# EAGLE design M640X (EAGLE 6.6.0)
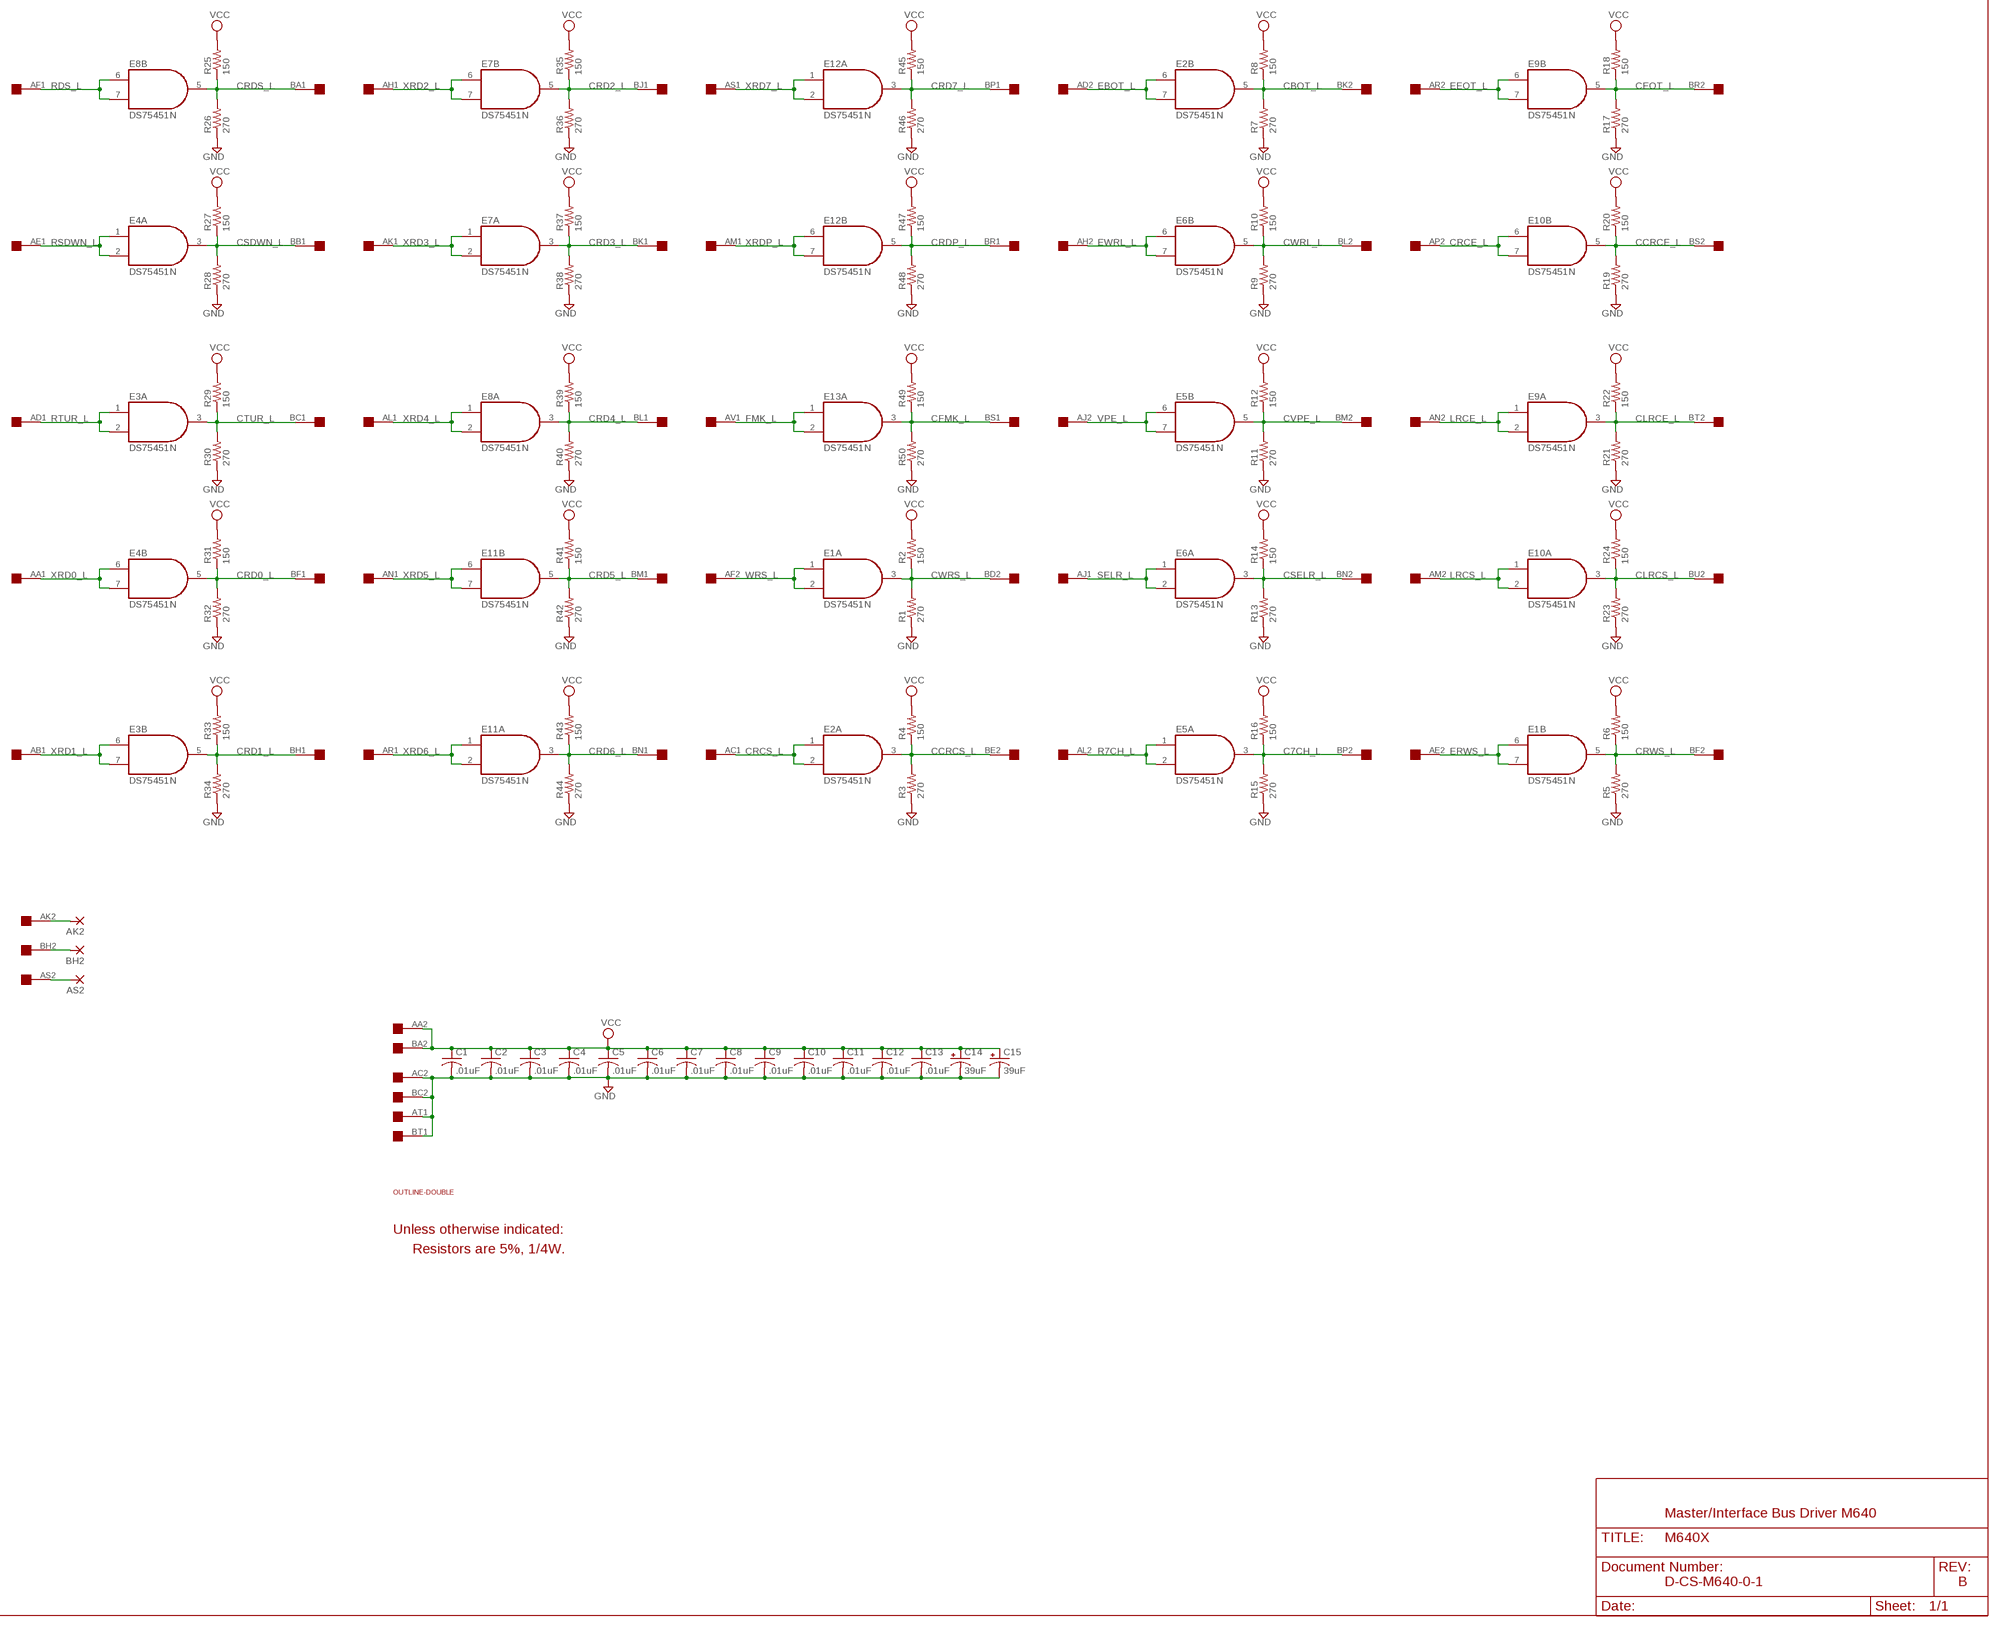
[diagram p0: schematic, sheet 1]

## Parts
AK2  1,6/0,8  [1,6/0,8]
AS2  1,6/0,8  [1,6/0,8]
BH2  1,6/0,8  [1,6/0,8]
C1  .01uF  C-US050-025X075  [C050-025X075]
C2  .01uF  C-US050-025X075  [C050-025X075]
C3  .01uF  C-US050-025X075  [C050-025X075]
C4  .01uF  C-US050-025X075  [C050-025X075]
C5  .01uF  C-US050-025X075  [C050-025X075]
C6  .01uF  C-US050-025X075  [C050-025X075]
C7  .01uF  C-US050-025X075  [C050-025X075]
C8  .01uF  C-US050-025X075  [C050-025X075]
C9  .01uF  C-US050-025X075  [C050-025X075]
C10  .01uF  C-US050-025X075  [C050-025X075]
C11  .01uF  C-US050-025X075  [C050-025X075]
C12  .01uF  C-US050-025X075  [C050-025X075]
C13  .01uF  C-US050-025X075  [C050-025X075]
C14  39uF  CPOL-USE20-8AXIAL  [E12-8]
C15  39uF  CPOL-USE20-8AXIAL  [E12-8]
E1  DS75451N  [DIL08]
E2  DS75451N  [DIL08]
E3  DS75451N  [DIL08]
E4  DS75451N  [DIL08]
E5  DS75451N  [DIL08]
E6  DS75451N  [DIL08]
E7  DS75451N  [DIL08]
E8  DS75451N  [DIL08]
E9  DS75451N  [DIL08]
E10  DS75451N  [DIL08]
E11  DS75451N  [DIL08]
E12  DS75451N  [DIL08]
E13  DS75451N  [DIL08]
R1  270  R-US_0207/10  [0207/10]
R2  150  R-US_0207/10  [0207/10]
R3  270  R-US_0207/10  [0207/10]
R4  150  R-US_0207/10  [0207/10]
R5  270  R-US_0207/10  [0207/10]
R6  150  R-US_0207/10  [0207/10]
R7  270  R-US_0207/10  [0207/10]
R8  150  R-US_0207/10  [0207/10]
R9  270  R-US_0207/10  [0207/10]
R10  150  R-US_0207/10  [0207/10]
R11  270  R-US_0207/10  [0207/10]
R12  150  R-US_0207/10  [0207/10]
R13  270  R-US_0207/10  [0207/10]
R14  150  R-US_0207/10  [0207/10]
R15  270  R-US_0207/10  [0207/10]
R16  150  R-US_0207/10  [0207/10]
R17  270  R-US_0207/10  [0207/10]
R18  150  R-US_0207/10  [0207/10]
R19  270  R-US_0207/10  [0207/10]
R20  150  R-US_0207/10  [0207/10]
R21  270  R-US_0207/10  [0207/10]
R22  150  R-US_0207/10  [0207/10]
R23  270  R-US_0207/10  [0207/10]
R24  150  R-US_0207/10  [0207/10]
R25  150  R-US_0207/10  [0207/10]
R26  270  R-US_0207/10  [0207/10]
R27  150  R-US_0207/10  [0207/10]
R28  270  R-US_0207/10  [0207/10]
R29  150  R-US_0207/10  [0207/10]
R30  270  R-US_0207/10  [0207/10]
R31  150  R-US_0207/10  [0207/10]
R32  270  R-US_0207/10  [0207/10]
R33  150  R-US_0207/10  [0207/10]
R34  270  R-US_0207/10  [0207/10]
R35  150  R-US_0207/10  [0207/10]
R36  270  R-US_0207/10  [0207/10]
R37  150  R-US_0207/10  [0207/10]
R38  270  R-US_0207/10  [0207/10]
R39  150  R-US_0207/10  [0207/10]
R40  270  R-US_0207/10  [0207/10]
R41  150  R-US_0207/10  [0207/10]
R42  270  R-US_0207/10  [0207/10]
R43  150  R-US_0207/10  [0207/10]
R44  270  R-US_0207/10  [0207/10]
R45  150  R-US_0207/10  [0207/10]
R46  270  R-US_0207/10  [0207/10]
R47  150  R-US_0207/10  [0207/10]
R48  270  R-US_0207/10  [0207/10]
R49  150  R-US_0207/10  [0207/10]
R50  270  R-US_0207/10  [0207/10]
U$1  DOUBLE  [EDGE-CON4]
U$2  OUTLINE-DOUBLE  [DOUBLE]

## Nets
C7CH_L: E5.3(A:O) R15.2 R16.1 U$1.BP2
CBOT_L: E2.5(B:O) R7.2 R8.1 U$1.BK2
CCRCE_L: E10.5(B:O) R19.2 R20.1 U$1.BS2
CCRCS_L: E2.3(A:O) R3.2 R4.1 U$1.BE2
CEOT_L: E9.5(B:O) R17.2 R18.1 U$1.BR2
CFMK_L: E13.3(A:O) R49.1 R50.2 U$1.BS1
CLRCE_L: E9.3(A:O) R21.2 R22.1 U$1.BT2
CLRCS_L: E10.3(A:O) R23.2 R24.1 U$1.BU2
CRCE_L: E10.6(B:I0) E10.7(B:I1) U$1.AP2
CRCS_L: E2.1(A:I0) E2.2(A:I1) U$1.AC1
CRD0_L: E4.5(B:O) R31.1 R32.2 U$1.BF1
CRD1_L: E3.5(B:O) R33.1 R34.2 U$1.BH1
CRD2_L: E7.5(B:O) R35.1 R36.2 U$1.BJ1
CRD3_L: E7.3(A:O) R37.1 R38.2 U$1.BK1
CRD4_L: E8.3(A:O) R39.1 R40.2 U$1.BL1
CRD5_L: E11.5(B:O) R41.1 R42.2 U$1.BM1
CRD6_L: E11.3(A:O) R43.1 R44.2 U$1.BN1
CRD7_L: E12.3(A:O) R45.1 R46.2 U$1.BP1
CRDP_L: E12.5(B:O) R47.1 R48.2 U$1.BR1
CRDS_L: E8.5(B:O) R25.1 R26.2 U$1.BA1
CRWS_L: E1.5(B:O) R5.2 R6.1 U$1.BF2
CSDWN_L: E4.3(A:O) R27.1 R28.2 U$1.BB1
CSELR_L: E6.3(A:O) R13.2 R14.1 U$1.BN2
CTUR_L: E3.3(A:O) R29.1 R30.2 U$1.BC1
CVPE_L: E5.5(B:O) R11.2 R12.1 U$1.BM2
CWRL_L: E6.5(B:O) R9.2 R10.1 U$1.BL2
CWRS_L: E1.3(A:O) R1.2 R2.1 U$1.BD2
EBOT_L: E2.6(B:I0) E2.7(B:I1) U$1.AD2
EEOT_L: E9.6(B:I0) E9.7(B:I1) U$1.AR2
ERWS_L: E1.6(B:I0) E1.7(B:I1) U$1.AE2
EWRL_L: E6.6(B:I0) E6.7(B:I1) U$1.AH2
FMK_L: E13.1(A:I0) E13.2(A:I1) U$1.AV1
GND [Supply]: C1.2 C2.2 C3.2 C4.2 C5.2 C6.2 C7.2 C8.2 C9.2 C10.2 C11.2 C12.2 C13.2 C14.- C15.- R1.1 R3.1 R5.1 R7.1 R9.1 R11.1 R13.1 R15.1 R17.1 R19.1 R21.1 R23.1 R26.1 R28.1 R30.1 R32.1 R34.1 R36.1 R38.1 R40.1 R42.1 R44.1 R46.1 R48.1 R50.1 U$1.AC2 U$1.AT1 U$1.BC2 U$1.BT1
LRCE_L: E9.1(A:I0) E9.2(A:I1) U$1.AN2
LRCS_L: E10.1(A:I0) E10.2(A:I1) U$1.AM2
N$1: AK2.1(P) U$1.AK2
N$2: BH2.1(P) U$1.BH2
N$3: AS2.1(P) U$1.AS2
R7CH_L: E5.1(A:I0) E5.2(A:I1) U$1.AL2
RDS_L: E8.6(B:I0) E8.7(B:I1) U$1.AF1
RSDWN_L: E4.1(A:I0) E4.2(A:I1) U$1.AE1
RTUR_L: E3.1(A:I0) E3.2(A:I1) U$1.AD1
SELR_L: E6.1(A:I0) E6.2(A:I1) U$1.AJ1
VCC [Supply]: C1.1 C2.1 C3.1 C4.1 C5.1 C6.1 C7.1 C8.1 C9.1 C10.1 C11.1 C12.1 C13.1 C14.+ C15.+ R2.2 R4.2 R6.2 R8.2 R10.2 R12.2 R14.2 R16.2 R18.2 R20.2 R22.2 R24.2 R25.2 R27.2 R29.2 R31.2 R33.2 R35.2 R37.2 R39.2 R41.2 R43.2 R45.2 R47.2 R49.2 U$1.AA2 U$1.BA2
VPE_L: E5.6(B:I0) E5.7(B:I1) U$1.AJ2
WRS_L: E1.1(A:I0) E1.2(A:I1) U$1.AF2
XRD0_L: E4.6(B:I0) E4.7(B:I1) U$1.AA1
XRD1_L: E3.6(B:I0) E3.7(B:I1) U$1.AB1
XRD2_L: E7.6(B:I0) E7.7(B:I1) U$1.AH1
XRD3_L: E7.1(A:I0) E7.2(A:I1) U$1.AK1
XRD4_L: E8.1(A:I0) E8.2(A:I1) U$1.AL1
XRD5_L: E11.6(B:I0) E11.7(B:I1) U$1.AN1
XRD6_L: E11.1(A:I0) E11.2(A:I1) U$1.AR1
XRD7_L: E12.1(A:I0) E12.2(A:I1) U$1.AS1
XRDP_L: E12.6(B:I0) E12.7(B:I1) U$1.AM1
Unconnected: E13.5(B:O) E13.6(B:I0) E13.7(B:I1) U$1.AB2 U$1.AP1 U$1.AT2 U$1.AU1 U$1.AU2 U$1.AV2 U$1.BB2 U$1.BD1 U$1.BE1 U$1.BJ2 U$1.BU1 U$1.BV1 U$1.BV2

## Notes on the sheet
- Unless otherwise indicated:
- Resistors are 5%, 1/4W.
- Master/Interface Bus Driver M640
- D-CS-M640-0-1 | B

## Power pins joined to a net without a drawn wire
GND: E1.4(PWR:GND) E2.4(PWR:GND) E3.4(PWR:GND) E4.4(PWR:GND) E5.4(PWR:GND) E6.4(PWR:GND) E7.4(PWR:GND) E8.4(PWR:GND) E9.4(PWR:GND) E10.4(PWR:GND) E11.4(PWR:GND) E12.4(PWR:GND) E13.4(PWR:GND)
VCC: E1.8(PWR:VCC) E2.8(PWR:VCC) E3.8(PWR:VCC) E4.8(PWR:VCC) E5.8(PWR:VCC) E6.8(PWR:VCC) E7.8(PWR:VCC) E8.8(PWR:VCC) E9.8(PWR:VCC) E10.8(PWR:VCC) E11.8(PWR:VCC) E12.8(PWR:VCC) E13.8(PWR:VCC)

## Library data of the parts
AK2 AS2 BH2 = wirepad:1,6/0,8: THROUGH-HOLE PAD
C1-C13 = rcl:C-US: CAPACITOR, American symbol
C14 C15 = dec-con:CPOL-USE20-8AXIAL: A 0.8 inch electrolytic.
E1-E13 = dec-con:DS75451
R1-R50 = rcl:R-US_: RESISTOR, American symbol
U$1 = dec-con:DOUBLE: Double-Height DEC board
U$2 = dec-con:OUTLINE-*: Board outlines for DEC boards.

## Net classes
1 Supply: width 0.813 mm

## Board
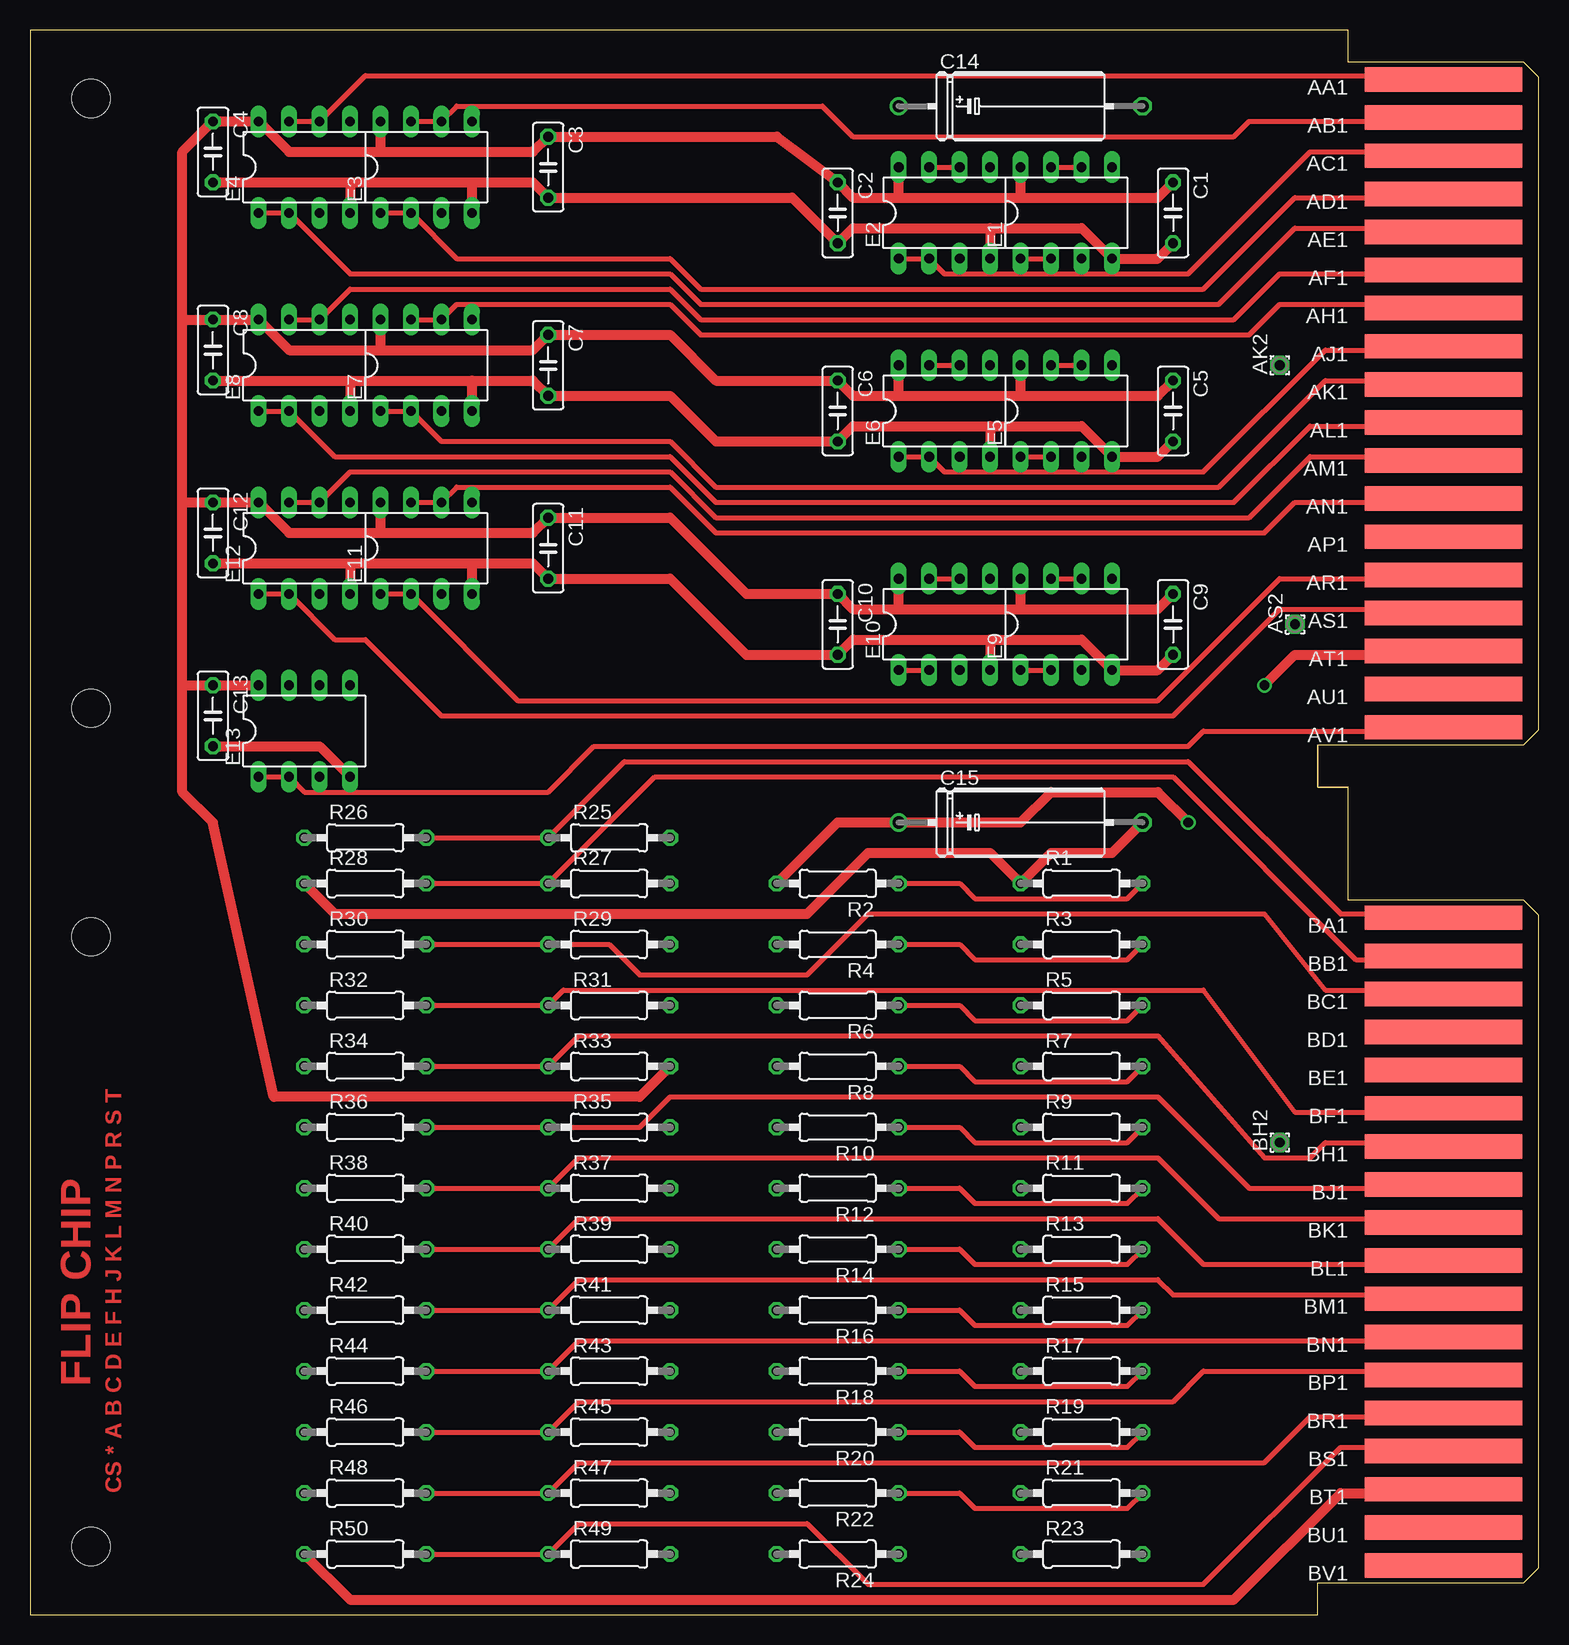
[diagram p1: board, top side]
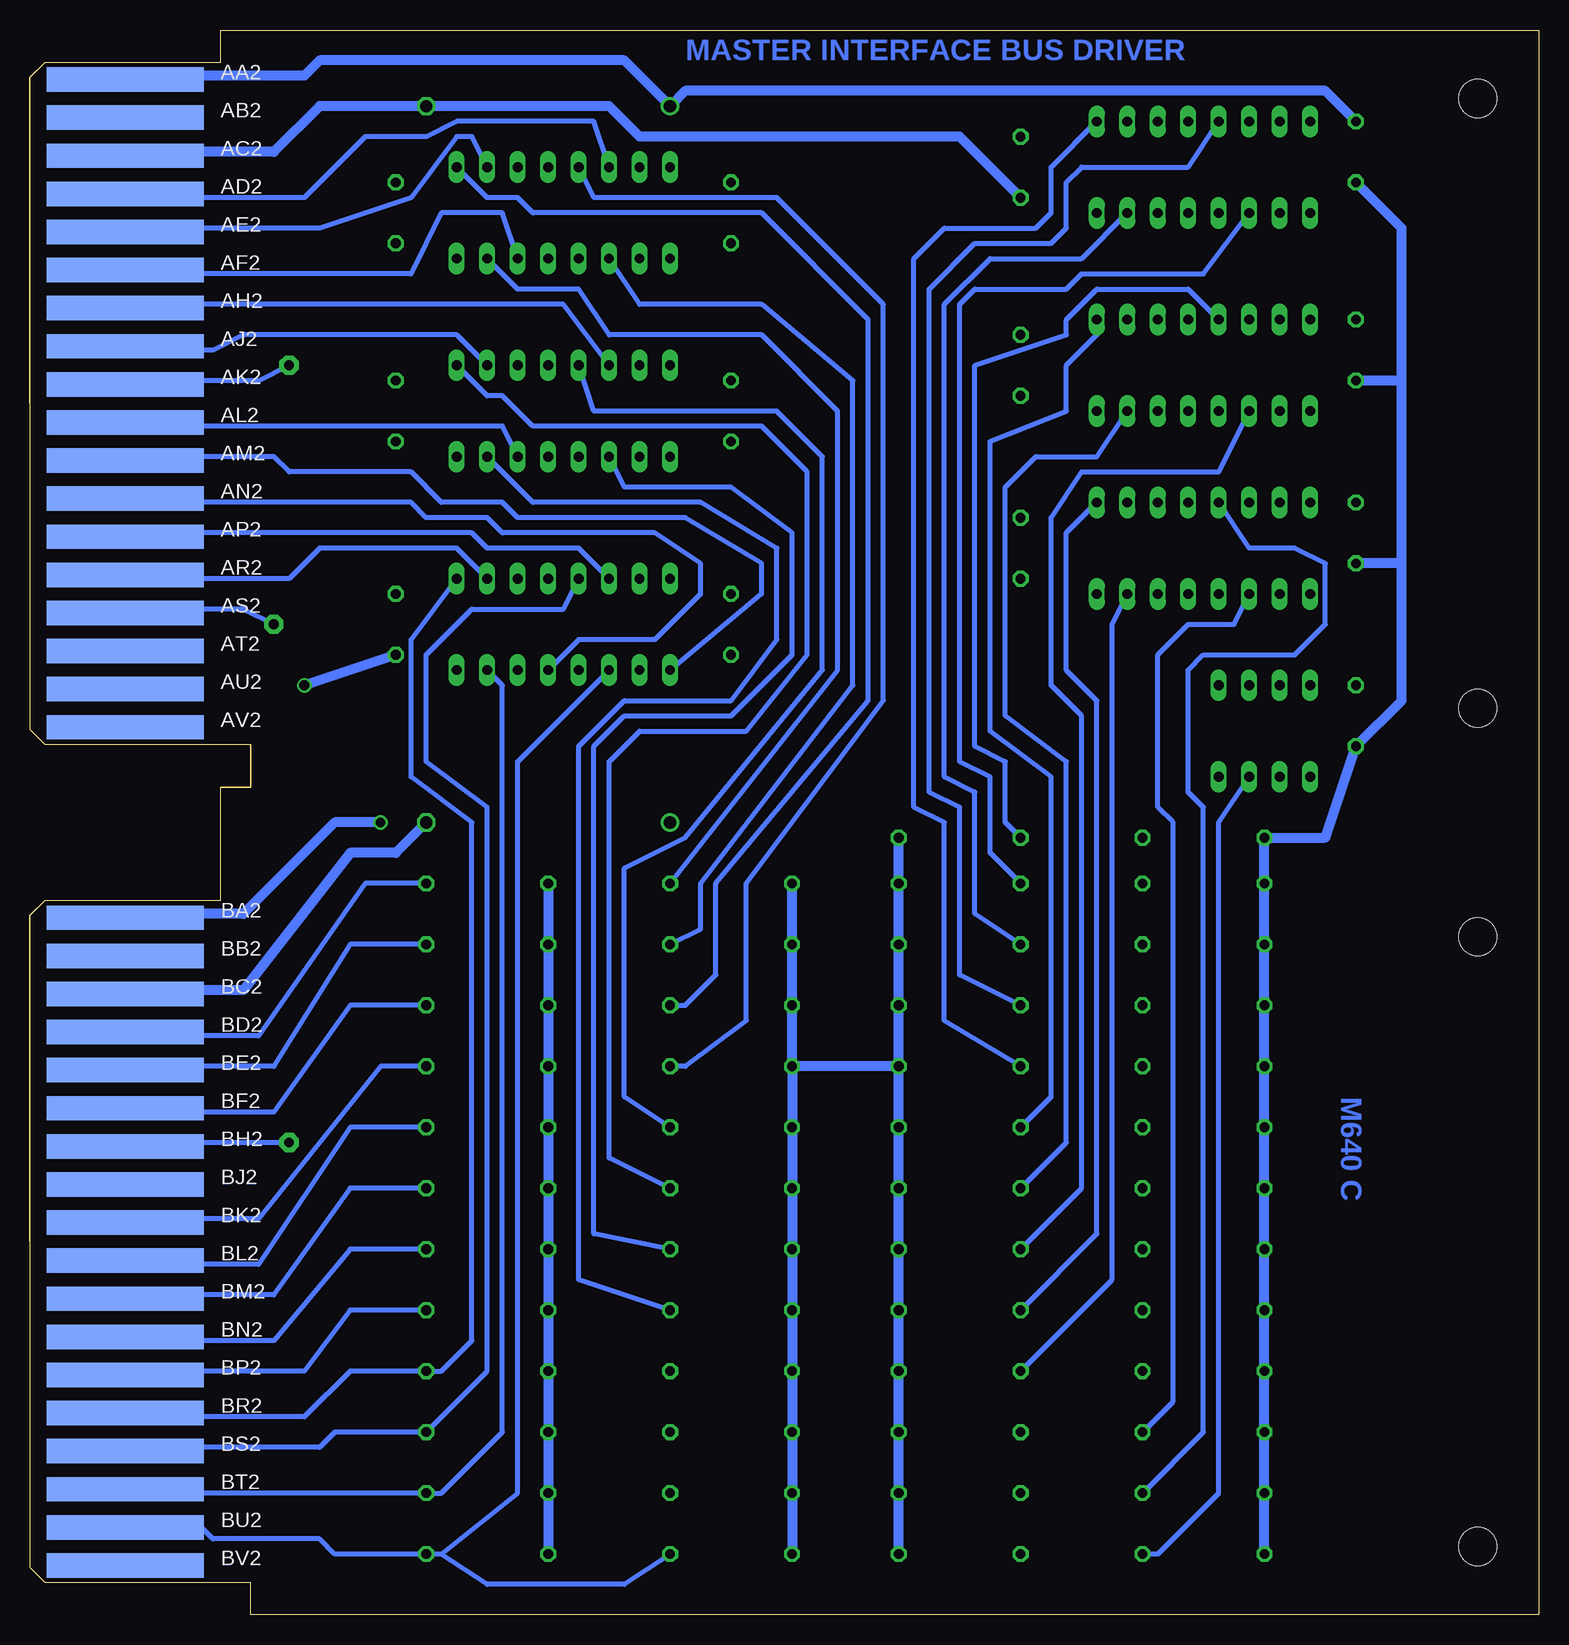
[diagram p2: board, bottom side, seen from below]

Size 125.73 x 132.08 mm. Coordinates in mm from the lower left corner, seen from the top.
Copper layers (1+16): Top 0.035mm / dielectric 1.5mm / Bottom 0.035mm
Design rules "16mils": minimum track width 16mil, minimum drill 32mil, track to track 15mil, track to pad 10mil, pad to pad 10mil, via to via 10mil, smd to smd 10mil, copper to edge 25mil, drill to drill 10mil, minimum pad ring 10mil, minimum via ring 8mil, stop-mask expansion 0mil, vias tented up to drill 0mil, thermal gap 10mil

### Footprints (pad centres in the part's own frame; a part is rotated, then mirrored left to right if it is on the bottom)
1,6/0,8 = drill 0.813 pad 1.6 octagon: 1 0,0
C050-025X075 = drill 0.813 octagon: 1 -2.54,0; 2 2.54,0
E12-8 = drill 1.016: + -10.16,0 | drill 1.016 octagon: - 10.16,0
DIL08 = drill 0.813 long: 1 -3.81,-3.81; 2 -1.27,-3.81; 3 1.27,-3.81; 4 3.81,-3.81; 5 3.81,3.81; 6 1.27,3.81; 7 -1.27,3.81; 8 -3.81,3.81
0207/10 = drill 0.813 octagon: 1 -5.08,0; 2 5.08,0
EDGE-CON4 = smd 13.106 x 2.032: AA1 7.938,4.128; AB1 7.938,7.303; AC1 7.938,10.477; AD1 7.938,13.652; AE1 7.938,16.828; AF1 7.938,20.003; AH1 7.938,23.177; AJ1 7.938,26.352; AK1 7.938,29.527; AL1 7.938,32.703; AM1 7.938,35.877; AN1 7.938,39.053; AP1 7.938,42.227; AR1 7.938,45.403; AS1 7.938,48.578; AT1 7.938,51.752; AU1 7.938,54.928; AV1 7.938,58.102; BA1 7.938,73.978; BB1 7.938,77.153; BC1 7.938,80.328; BD1 7.938,83.502; BE1 7.938,86.677; BF1 7.938,89.853; BH1 7.938,93.028; BJ1 7.938,96.203; BK1 7.938,99.377; BL1 7.938,102.552; BM1 7.938,105.728; BN1 7.938,108.903; BP1 7.938,112.078; BR1 7.938,115.252; BS1 7.938,118.427; BT1 7.938,121.603; BU1 7.938,124.778; BV1 7.938,127.953 | smd 13.106 x 2.032 bottom: AA2 7.938,4.128; AB2 7.938,7.303; AC2 7.938,10.477; AD2 7.938,13.652; AE2 7.938,16.828; AF2 7.938,20.003; AH2 7.938,23.177; AJ2 7.938,26.352; AK2 7.938,29.527; AL2 7.938,32.703; AM2 7.938,35.877; AN2 7.938,39.053; AP2 7.938,42.227; AR2 7.938,45.403; AS2 7.938,48.578; AT2 7.938,51.752; AU2 7.938,54.928; AV2 7.938,58.102; BA2 7.938,73.978; BB2 7.938,77.153; BC2 7.938,80.328; BD2 7.938,83.502; BE2 7.938,86.677; BF2 7.938,89.853; BH2 7.938,93.028; BJ2 7.938,96.203; BK2 7.938,99.377; BL2 7.938,102.552; BM2 7.938,105.728; BN2 7.938,108.903; BP2 7.938,112.078; BR2 7.938,115.252; BS2 7.938,118.427; BT2 7.938,121.603; BU2 7.938,124.778; BV2 7.938,127.953
DOUBLE = hole 3.175: 120.65,56.515; 120.65,5.715; 120.65,75.565; 120.65,126.365

### Placement (x,y rotation side)
AK2  104.14,104.14 90 top
AS2  105.41,82.55 90 top
BH2  104.14,39.37 90 top
C1  95.25,116.84 270 top
C2  67.31,116.84 270 top
C3  43.18,120.65 270 top
C4  15.24,121.92 270 top
C5  95.25,100.33 270 top
C6  67.31,100.33 270 top
C7  43.18,104.14 270 top
C8  15.24,105.41 270 top
C9  95.25,82.55 270 top
C10  67.31,82.55 270 top
C11  43.18,88.9 270 top
C12  15.24,90.17 270 top
C13  15.24,74.93 270 top
C14  82.55,125.73 0 top
C15  82.55,66.04 0 top
E1  86.36,116.84 0 top
E2  76.2,116.84 0 top
E3  33.02,120.65 0 top
E4  22.86,120.65 0 top
E5  86.36,100.33 0 top
E6  76.2,100.33 0 top
E7  33.02,104.14 0 top
E8  22.86,104.14 0 top
E9  86.36,82.55 0 top
E10  76.2,82.55 0 top
E11  33.02,88.9 0 top
E12  22.86,88.9 0 top
E13  22.86,73.66 0 top
R1  87.63,60.96 0 top
R2  67.31,60.96 180 top
R3  87.63,55.88 0 top
R4  67.31,55.88 180 top
R5  87.63,50.8 0 top
R6  67.31,50.8 180 top
R7  87.63,45.72 0 top
R8  67.31,45.72 180 top
R9  87.63,40.64 0 top
R10  67.31,40.64 180 top
R11  87.63,35.56 0 top
R12  67.31,35.56 180 top
R13  87.63,30.48 0 top
R14  67.31,30.48 180 top
R15  87.63,25.4 0 top
R16  67.31,25.4 180 top
R17  87.63,20.32 0 top
R18  67.31,20.32 180 top
R19  87.63,15.24 0 top
R20  67.31,15.24 180 top
R21  87.63,10.16 0 top
R22  67.31,10.16 180 top
R23  87.63,5.08 0 top
R24  67.31,5.08 180 top
R25  48.26,64.77 0 top
R26  27.94,64.77 0 top
R27  48.26,60.96 0 top
R28  27.94,60.96 0 top
R29  48.26,55.88 0 top
R30  27.94,55.88 0 top
R31  48.26,50.8 0 top
R32  27.94,50.8 0 top
R33  48.26,45.72 0 top
R34  27.94,45.72 0 top
R35  48.26,40.64 0 top
R36  27.94,40.64 0 top
R37  48.26,35.56 0 top
R38  27.94,35.56 0 top
R39  48.26,30.48 0 top
R40  27.94,30.48 0 top
R41  48.26,25.4 0 top
R42  27.94,25.4 0 top
R43  48.26,20.32 0 top
R44  27.94,20.32 0 top
R45  48.26,15.24 0 top
R46  27.94,15.24 0 top
R47  48.26,10.16 0 top
R48  27.94,10.16 0 top
R49  48.26,5.08 0 top
R50  27.94,5.08 0 top
U$1  125.73,132.08 180 top
U$2  125.73,132.08 180 top
U$4  [FLIPCHIP]  0,0 0 top

### Tracks (layer width: path | path; a pad name or v marks a point on that pad's centre or on a via)
C7CH_L
  Top 0.406: R15.2 91.44,24.13 78.74,24.13 77.47,25.4 R16.1
  Bottom 0.406: R15.2 99.06,25.4 102.87,20.32 116.84,20.32 U$1.BP2 | R16.1 80.01,27.94 80.01,72.39 76.2,76.2 67.31,76.2 63.5,81.28 63.5,88.9 69.85,92.71 83.82,92.71 E5.3
CBOT_L
  Top 0.406: R8.1 77.47,45.72 78.74,44.45 91.44,44.45 R7.2
  Bottom 0.406: U$1.BK2 116.84,33.02 106.68,33.02 96.52,45.72 R7.2 | R8.1 71.12,45.72 66.04,49.53 66.04,60.96 54.61,76.2 54.61,109.22 63.5,118.11 78.74,118.11 E2.5
CCRCE_L
  Top 0.406: R20.1 77.47,15.24 78.74,13.97 91.44,13.97 R19.2
  Bottom 0.406: U$1.BS2 117.14,13.66 116.84,13.97 101.6,13.97 100.33,15.24 R19.2 87.63,20.32 87.63,67.31 92.71,71.12 92.71,80.01 88.9,83.82 81.28,83.82 E10.5
CCRCS_L
  Top 0.406: R4.1 77.47,55.88 78.74,54.61 91.44,54.61 R3.2
  Bottom 0.406: U$1.BE2 116.84,45.72 105.41,45.72 99.06,55.88 R3.2 | E2.3 74.93,109.22 64.77,109.22 57.15,102.87 57.15,77.47 69.85,60.96 69.85,57.15 R4.1
CEOT_L
  Top 0.406: R18.1 77.47,20.32 78.74,19.05 91.44,19.05 R17.2
  Bottom 0.406: U$1.BR2 116.84,16.51 102.87,16.51 99.06,20.32 R17.2 91.44,20.32 88.9,22.86 88.9,66.04 93.98,69.85 93.98,81.28 E9.5
CFMK_L
  Top 0.406: R50.2 R49.1 45.72,7.62 64.77,7.62 69.85,2.54 97.79,2.54 109.22,13.97 116.84,13.97 U$1.BS1
  Bottom 0.406: R50.2 31.75,5.08 26.67,10.16 26.67,66.04 E13.3
CLRCE_L
  Top 0.406: R22.1 77.47,10.16 78.74,8.89 91.44,8.89 R21.2
  Bottom 0.406: U$1.BT2 117.17,10.49 116.84,10.16 R21.2 91.44,10.16 86.36,15.24 86.36,77.47 E9.3
CLRCS_L
  Bottom 0.406: U$1.BU2 117.2,7.26 116.84,7.62 111.76,7.62 110.49,6.35 101.6,6.35 100.33,5.08 R23.2 91.44,5.08 | R24.1 76.2,2.54 87.63,2.54 91.44,5.08 | E10.3 85.09,71.12 85.09,10.16 91.44,5.08
CRCE_L
  Top 0.406: E10.7 E10.6
  Bottom 0.406: U$1.AP2 116.84,90.17 88.9,90.17 87.63,88.9 80.01,88.9 E10.6
CRCS_L
  Top 0.406: E2.1 E2.2 76.2,111.76 96.52,111.76 106.68,121.92 116.84,121.92 U$1.AC1
CRD0_L
  Top 0.406: R32.2 R31.1 44.45,52.07 97.79,52.07 105.41,41.91 116.84,41.91 U$1.BF1
  Bottom 0.406: R31.1 48.26,53.34 48.26,67.31 50.8,68.58 50.8,110.49 46.99,114.3 40.64,114.3 39.37,115.57 39.37,119.38 38.1,120.65 29.21,120.65 E4.5
CRD1_L
  Top 0.406: R34.2 R33.1 45.72,48.26 93.98,48.26 102.87,38.1 106.68,38.1 107.95,39.37 116.84,39.37 U$1.BH1
  Bottom 0.406: R33.1 49.53,49.53 49.53,66.04 52.07,67.31 52.07,113.03 49.53,115.57 41.91,115.57 40.64,116.84 40.64,120.65 E3.5
CRD2_L
  Top 0.406: R36.2 R35.1 50.8,40.64 53.34,43.18 93.98,43.18 101.6,35.56 116.84,35.56 U$1.BJ1
  Bottom 0.406: R35.1 40.64,43.18 40.64,69.85 45.72,73.66 45.72,97.79 39.37,100.33 39.37,104.14 36.83,106.68 E7.5
CRD3_L
  Top 0.406: R38.2 R37.1 45.72,38.1 93.98,38.1 99.06,33.02 116.84,33.02 U$1.BK1
  Bottom 0.406: R37.1 39.37,39.37 39.37,71.12 44.45,74.93 44.45,93.98 41.91,96.52 36.83,96.52 E7.3
CRD4_L
  Top 0.406: R40.2 R39.1 45.72,33.02 93.98,33.02 97.79,29.21 116.84,29.21 U$1.BL1
  Bottom 0.406: R39.1 38.1,35.56 38.1,74.93 40.64,77.47 40.64,91.44 38.1,95.25 26.67,95.25 E8.3
CRD5_L
  Top 0.406: R42.2 R41.1 45.72,27.94 93.98,27.94 95.25,26.67 116.84,26.67 U$1.BM1
  Bottom 0.406: R41.1 36.83,31.75 36.83,76.2 39.37,78.74 39.37,90.17 E11.5
CRD6_L
  Top 0.406: R44.2 R43.1 45.72,22.86 116.84,22.86 U$1.BN1
  Bottom 0.406: R43.1 35.56,27.94 35.56,82.55 E11.3
CRD7_L
  Top 0.406: R46.2 R45.1 45.72,17.78 95.25,17.78 97.79,20.32 116.84,20.32 U$1.BP1
  Bottom 0.406: R46.2 30.48,17.78 30.48,66.04 31.75,67.31 31.75,80.01 29.21,82.55 25.4,82.55 E12.3
CRDP_L
  Top 0.406: R48.2 R47.1 45.72,12.7 102.87,12.7 106.68,16.51 116.84,16.51 U$1.BR1
  Bottom 0.406: R48.2 27.94,15.24 27.94,67.31 29.21,68.58 29.21,78.74 27.94,80.01 20.32,80.01 17.78,82.55 17.78,87.63 20.32,88.9 24.13,88.9 E12.5
CRDS_L
  Top 0.406: R26.2 R25.1 49.53,71.12 96.52,71.12 109.22,58.42 116.84,58.42 U$1.BA1
  Bottom 0.406: R25.1 44.45,66.04 44.45,71.12 46.99,72.39 46.99,104.14 39.37,106.68 39.37,107.95 36.83,110.49 29.21,110.49 E8.5
CRWS_L
  Top 0.406: R6.1 77.47,50.8 78.74,49.53 91.44,49.53 R5.2
  Bottom 0.406: R5.2 99.06,50.8 105.41,41.91 116.84,41.91 U$1.BF2 | R6.1 71.12,50.8 68.58,53.34 68.58,60.96 55.88,76.2 55.88,107.95 64.77,116.84 83.82,116.84 85.09,118.11 87.63,118.11 E1.5
CSDWN_L
  Top 0.406: R28.2 R27.1 52.07,69.85 95.25,69.85 110.49,54.61 116.84,54.61 U$1.BB1
  Bottom 0.406: R27.1 45.72,63.5 45.72,69.85 48.26,71.12 48.26,109.22 46.99,110.49 39.37,110.49 38.1,111.76 27.94,111.76 E4.3
CSELR_L
  Top 0.406: R13.2 91.44,29.21 78.74,29.21 77.47,30.48 R14.1
  Bottom 0.406: R13.2 99.06,30.48 105.41,22.86 116.84,22.86 U$1.BN2 | R14.1 78.74,31.75 78.74,72.39 76.2,74.93 67.31,74.93 62.23,80.01 62.23,90.17 67.31,93.98 76.2,93.98 E6.3
CTUR_L
  Top 0.406: R30.2 R29.1 48.26,55.88 50.8,53.34 64.77,53.34 69.85,58.42 102.87,58.42 107.95,52.07 116.84,52.07 U$1.BC1
  Bottom 0.406: R29.1 46.99,58.42 46.99,68.58 49.53,69.85 49.53,109.22 45.72,113.03 38.1,113.03 E3.3
CVPE_L
  Top 0.406: R11.2 91.44,34.29 78.74,34.29 77.47,35.56 R12.1
  Bottom 0.406: U$1.BM2 116.84,26.67 105.41,26.67 99.06,35.56 R11.2 | R12.1 77.47,38.1 77.47,71.12 74.93,73.66 66.04,73.66 60.96,80.01 60.96,95.25 64.77,99.06 83.82,99.06 86.36,101.6 87.63,101.6 E5.5
CWRL_L
  Top 0.406: R9.2 91.44,39.37 78.74,39.37 77.47,40.64 R10.1
  Bottom 0.406: U$1.BL2 116.84,29.21 106.68,29.21 99.06,40.64 R9.2 | R10.1 76.2,43.18 76.2,62.23 71.12,64.77 59.69,78.74 59.69,96.52 63.5,100.33 78.74,100.33 E6.5
CWRS_L
  Top 0.406: R2.1 77.47,60.96 78.74,59.69 91.44,59.69 R1.2
  Bottom 0.406: U$1.BD2 117.14,48.56 116.84,48.26 106.68,48.26 97.79,60.96 R1.2 | R2.1 58.42,78.74 58.42,100.33 64.77,106.68 77.47,106.68 80.01,110.49 85.09,110.49 E1.3
EBOT_L
  Top 0.406: E2.7 E2.6
  Bottom 0.406: U$1.AD2 116.84,118.11 102.87,118.11 97.79,123.19 92.71,123.19 90.17,124.46 78.74,124.46 E2.6
EEOT_L
  Top 0.406: E9.7 E9.6
  Bottom 0.406: U$1.AR2 116.84,86.36 104.14,86.36 101.6,88.9 90.17,88.9 E9.6
ERWS_L
  Top 0.406: E1.7 E1.6
  Bottom 0.406: U$1.AE2 116.84,115.57 101.6,115.57 93.98,118.11 90.17,123.19 88.9,123.19 E1.6
EWRL_L
  Top 0.406: E6.7 E6.6
  Bottom 0.406: U$1.AH2 115.57,109.22 81.28,109.22 E6.6
FMK_L
  Top 0.406: E13.1 E13.2 22.86,68.58 43.18,68.58 46.99,72.39 96.52,72.39 97.79,73.66 116.84,73.66 U$1.AV1
GND  (via drill 0.81)
  Top 0.813: U$1.BT1 116.84,10.16 109.22,10.16 100.33,1.27 26.67,1.27 R50.1 | 80.01,115.57 68.58,115.57 C2.2 63.5,118.11 C3.2 41.91,119.38 36.83,119.38 | 80.01,115.57 E2.4 | 80.01,115.57 87.63,115.57 E1.4 93.98,113.03 C1.2 | 80.01,99.06 68.58,99.06 C6.2 57.15,97.79 53.34,101.6 C7.2 41.91,102.87 36.83,102.87 | 80.01,99.06 87.63,99.06 E5.4 93.98,96.52 C5.2 | 80.01,99.06 E6.4 | 80.01,81.28 68.58,81.28 C10.2 59.69,80.01 53.34,86.36 C11.2 41.91,87.63 36.83,87.63 | 80.01,81.28 87.63,81.28 E9.4 93.98,78.74 C9.2 | 80.01,81.28 E10.4 | R28.1 25.4,58.42 64.77,58.42 69.85,63.5 80.01,63.5 R1.1 85.09,63.5 90.17,63.5 C15.- | E13.4 24.13,72.39 C13.2 | C12.2 26.67,87.63 | 26.67,87.63 E12.4 | 36.83,87.63 E11.4 | 26.67,87.63 36.83,87.63 | C8.2 26.67,102.87 | 26.67,102.87 36.83,102.87 | 26.67,102.87 E8.4 | 36.83,102.87 E7.4 | C4.2 26.67,119.38 | 26.67,119.38 36.83,119.38 | 36.83,119.38 E3.4 | 26.67,119.38 E4.4 | U$1.AT1 116.84,80.01 105.41,80.01 v102.87,77.47
  Bottom 0.813: C4.2 11.43,115.57 11.43,102.87 | 11.43,87.63 11.43,76.2 C13.2 17.78,64.77 R26.1 R28.1 R30.1 R32.1 R34.1 R36.1 R38.1 R40.1 R42.1 R44.1 R46.1 R48.1 R50.1 | 11.43,87.63 11.43,102.87 | 11.43,87.63 C12.2 | 11.43,102.87 C8.2 | R23.1 R21.1 R19.1 R17.1 R15.1 R13.1 R11.1 R9.1 R7.1 R5.1 R3.1 R1.1 | U$1.AC2 117.17,121.59 116.84,121.92 105.41,121.92 101.6,125.73 C14.- 77.47,125.73 74.93,123.19 48.26,123.19 C3.2 | U$1.BC2 117.17,51.74 116.84,52.07 107.95,52.07 99.06,63.5 95.25,63.5 C15.- | C9.2 v102.87,77.47
LRCE_L
  Top 0.406: E9.1 E9.2
  Bottom 0.406: U$1.AN2 116.84,92.71 93.98,92.71 92.71,91.44 87.63,91.44 86.36,90.17 73.66,90.17 69.85,87.63 69.85,85.09 73.66,81.28 80.01,81.28 E9.1
LRCS_L
  Top 0.406: E10.1 E10.2
  Bottom 0.406: U$1.AM2 116.84,96.52 105.41,96.52 104.14,95.25 93.98,95.25 91.44,92.71 86.36,92.71 85.09,91.44 71.12,91.44 64.77,87.63 64.77,85.09 E10.1
N$1
  Bottom 0.406: U$1.AK2 116.84,102.87 106.68,102.87 AK2.1
N$2
  Bottom 0.406: U$1.BH2 116.84,39.37 BH2.1
N$3
  Bottom 0.406: U$1.AS2 116.84,83.82 107.95,83.82 AS2.1
R7CH_L
  Top 0.406: E5.1 E5.2
  Bottom 0.406: U$1.AL2 116.84,99.06 86.36,99.06 E5.2
RDS_L
  Top 0.406: E8.7 E8.6 26.67,110.49 53.34,110.49 55.88,107.95 100.33,107.95 104.14,111.76 116.84,111.76 U$1.AF1
RSDWN_L
  Top 0.406: E4.1 E4.2 26.67,111.76 53.34,111.76 55.88,109.22 99.06,109.22 105.41,115.57 116.84,115.57 U$1.AE1
RTUR_L
  Top 0.406: E3.1 E3.2 35.56,113.03 53.34,113.03 55.88,110.49 97.79,110.49 105.41,118.11 116.84,118.11 U$1.AD1
SELR_L
  Top 0.406: E6.1 E6.2 76.2,95.25 97.79,95.25 107.95,105.41 116.84,105.41 U$1.AJ1
VCC  (via drill 0.81)
  Top 0.813: E13.8 C13.1 12.7,77.47 | 72.39,118.11 68.58,118.11 C2.1 62.23,123.19 C3.1 41.91,121.92 29.21,121.92 | 72.39,118.11 82.55,118.11 | 82.55,118.11 E1.8 | 72.39,118.11 E2.8 | C1.1 93.98,118.11 82.55,118.11 | 72.39,101.6 68.58,101.6 C6.1 57.15,102.87 53.34,106.68 C7.1 41.91,105.41 29.21,105.41 | 72.39,101.6 82.55,101.6 | 82.55,101.6 93.98,101.6 C5.1 | 82.55,101.6 E5.8 | 72.39,101.6 E6.8 | 72.39,83.82 68.58,83.82 C10.1 59.69,85.09 53.34,91.44 C11.1 41.91,90.17 29.21,90.17 | 72.39,83.82 82.55,83.82 | 82.55,83.82 93.98,83.82 C9.1 | 82.55,83.82 E9.8 | 72.39,83.82 E10.8 | R2.2 67.31,66.04 C15.+ 82.55,66.04 85.09,68.58 93.98,68.58 v96.52,66.04 | 29.21,90.17 21.59,90.17 E12.8 C12.1 12.7,92.71 | 29.21,90.17 E11.8 | 12.7,77.47 12.7,92.71 | 12.7,92.71 12.7,107.95 | 12.7,107.95 12.7,121.92 C4.1 E4.8 21.59,121.92 29.21,121.92 | 12.7,107.95 C8.1 E8.8 21.59,105.41 29.21,105.41 | R33.2 50.8,43.18 20.32,43.18 15.24,66.04 12.7,68.58 12.7,77.47 | 29.21,105.41 E7.8 | 29.21,121.92 E3.8
  Bottom 0.813: U$1.AA2 117.24,127.87 116.84,128.27 102.87,128.27 101.6,129.54 76.2,129.54 C14.+ 71.12,127 17.78,127 C4.1 | R49.2 R47.2 R45.2 R43.2 R41.2 R39.2 R37.2 R35.2 R33.2 | R24.2 R22.2 R20.2 R18.2 R16.2 R14.2 R12.2 R10.2 R8.2 | R33.2 R8.2 | R25.2 R27.2 R29.2 R31.2 R33.2 | R8.2 R6.2 R4.2 R2.2 | U$1.BA2 117.24,58.02 116.84,58.42 107.95,58.42 100.33,66.04 v96.52,66.04
VPE_L
  Top 0.406: E5.7 E5.6
  Bottom 0.406: U$1.AJ2 116.84,105.41 110.49,105.41 107.95,106.68 90.17,106.68 E5.6
WRS_L
  Top 0.406: E1.1 E1.2
  Bottom 0.406: U$1.AF2 116.84,111.76 93.98,111.76 91.44,116.84 86.36,116.84 E1.2
XRD0_L
  Top 0.406: E4.7 E4.6 27.94,128.27 116.84,128.27 U$1.AA1
XRD1_L
  Top 0.406: E3.7 E3.6 35.56,125.73 66.04,125.73 68.58,123.19 100.33,123.19 101.6,124.46 116.84,124.46 U$1.AB1
XRD2_L
  Top 0.406: E7.7 E7.6 35.56,109.22 53.34,109.22 55.88,106.68 101.6,106.68 104.14,109.22 116.84,109.22 U$1.AH1
XRD3_L
  Top 0.406: E7.1 E7.2 34.29,97.79 53.34,97.79 57.15,93.98 99.06,93.98 107.95,102.87 116.84,102.87 U$1.AK1
XRD4_L
  Top 0.406: E8.1 E8.2 25.4,96.52 53.34,96.52 57.15,92.71 100.33,92.71 106.68,99.06 116.84,99.06 U$1.AL1
XRD5_L
  Top 0.406: E11.7 E11.6 35.56,93.98 53.34,93.98 57.15,90.17 102.87,90.17 105.41,92.71 116.84,92.71 U$1.AN1
XRD6_L
  Top 0.406: E11.1 E11.2 40.64,76.2 93.98,76.2 104.14,86.36 116.84,86.36 U$1.AR1
XRD7_L
  Top 0.406: E12.1 E12.2 25.4,81.28 27.94,81.28 34.29,74.93 95.25,74.93 104.14,83.82 116.84,83.82 U$1.AS1
XRDP_L
  Top 0.406: E12.7 E12.6 26.67,95.25 53.34,95.25 57.15,91.44 101.6,91.44 106.68,96.52 116.84,96.52 U$1.AM1

### Text on the board
Top: CS * A B C D E F H J K L M N P R S T
Bottom: MASTER INTERFACE BUS DRIVER | M640 C